# EAGLE design hatest (EAGLE 5.10)
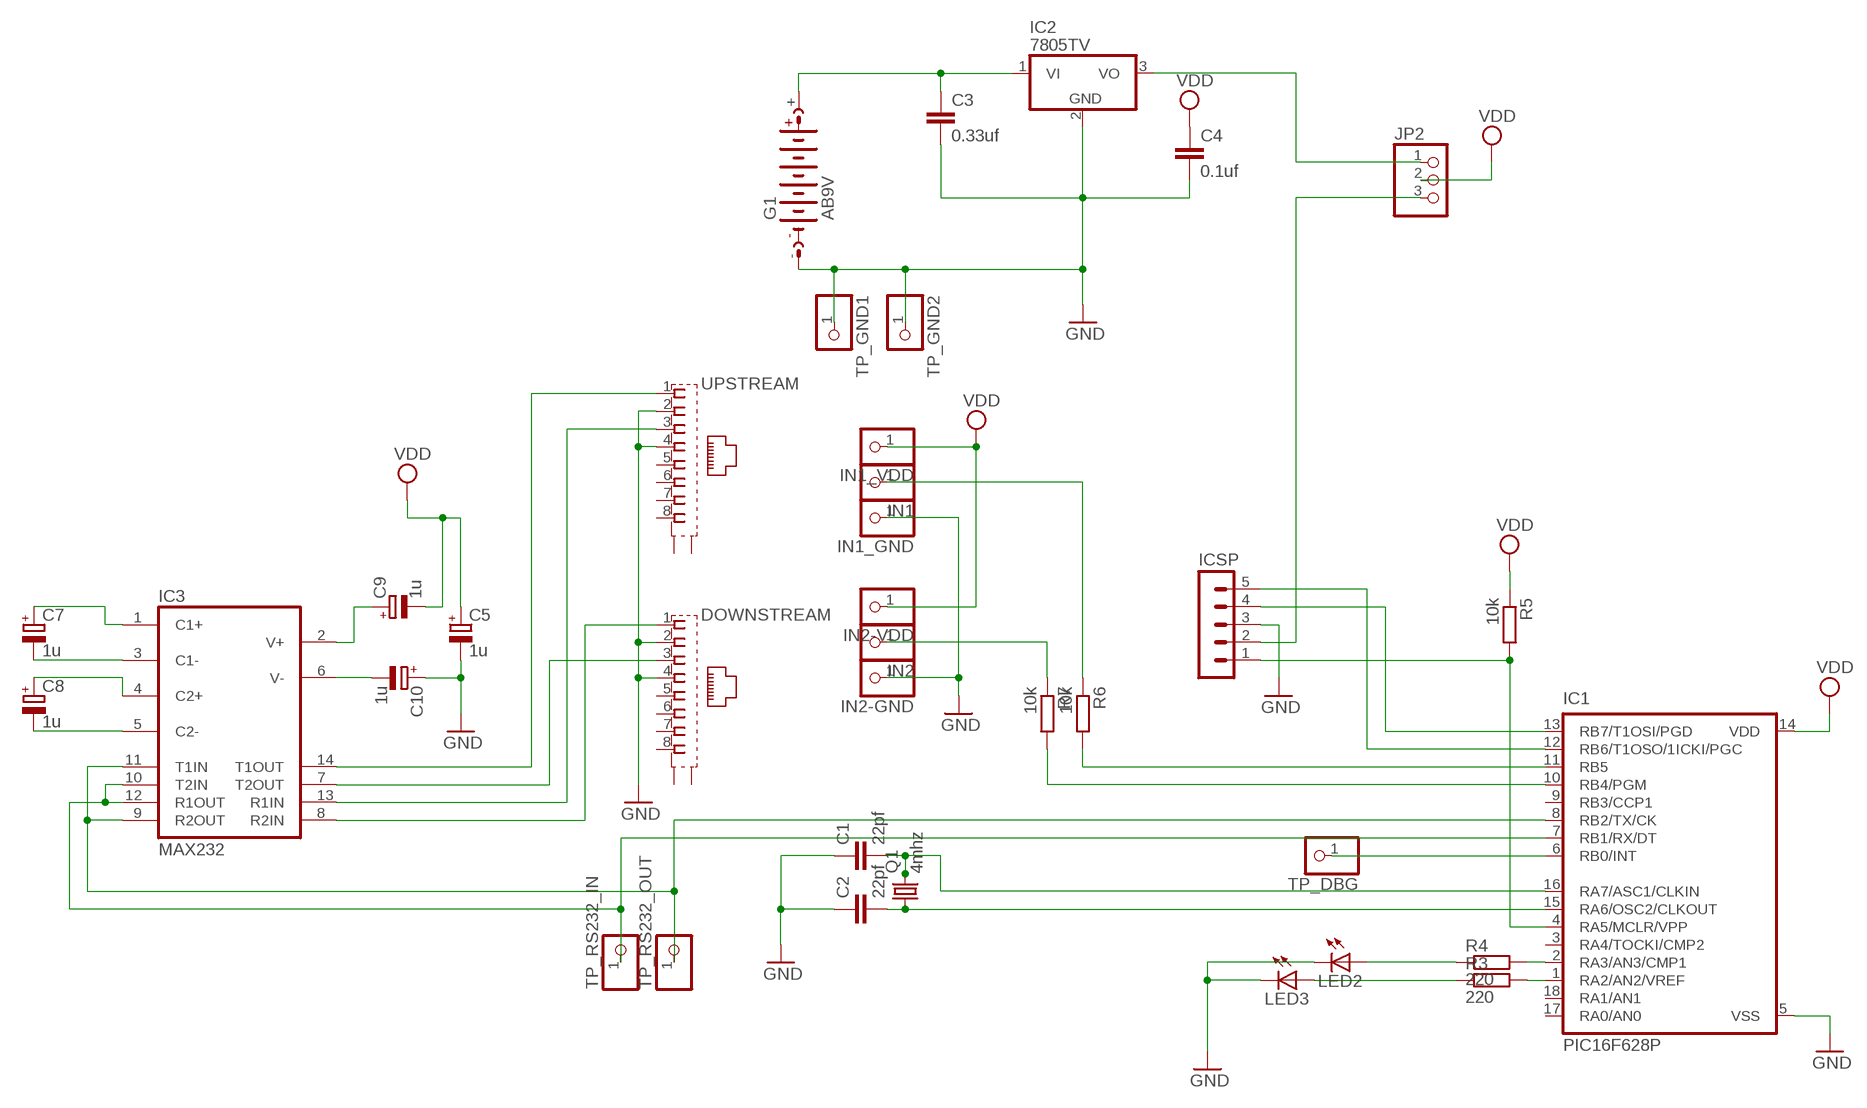
[diagram p0: schematic, sheet 1]

## Parts
C1  22pf  C-EU075-032X103  [C075-032X103]
C2  22pf  C-EU075-032X103  [C075-032X103]
C3  0.33uf  C5/3  [C5B3]
C4  0.1uf  C5/3  [C5B3]
C5  1u  CPOL-EUE2.5-6  [E2,5-6]
C7  1u  CPOL-EUE2.5-6  [E2,5-6]
C8  1u  CPOL-EUE2.5-6  [E2,5-6]
C9  1u  CPOL-EUE2.5-6  [E2,5-6]
C10  1u  CPOL-EUE2.5-6  [E2,5-6]
DOWNSTREAM  555153-1  [555153-1]
G1  AB9V  [AB9V]
IC1  PIC16F628P  [DIL18]
IC2  7805TV  [TO220V]
IC3  MAX232  [DIL16]
ICSP  MA05-1  [MA05-1]
IN1  PINHD-1X1  [1X01]
IN1_GND  PINHD-1X1  [1X01]
IN1_VDD  PINHD-1X1  [1X01]
IN2  PINHD-1X1  [1X01]
IN2-GND  PINHD-1X1  [1X01]
IN2-VDD  PINHD-1X1  [1X01]
JP2  PINHD-1X3  [1X03]
LED2  LED5MM  [LED5MM]
LED3  LED5MM  [LED5MM]
Q1  4mhz  CRYSTALHC49S  [HC49/S]
R3  220  R-EU_0411/15  [0411/15]
R4  220  R-EU_0411/15  [0411/15]
R5  10k  R-EU_0309/12  [0309/12]
R6  10k  R-EU_0204/5  [0204/5]
R7  10k  R-EU_0204/5  [0204/5]
TP_DBG  PINHD-1X1  [1X01]
TP_GND1  PINHD-1X1  [1X01]
TP_GND2  PINHD-1X1  [1X01]
TP_RS232_IN  PINHD-1X1  [1X01]
TP_RS232_OUT  PINHD-1X1  [1X01]
UPSTREAM  555153-1  [555153-1]

## Nets
9V: C3.1 G1.+ IC2.1(VI)
GND: C1.1 C2.1 C3.2 C4.2 C5.- C10.+ DOWNSTREAM.2 DOWNSTREAM.4 G1.- IC1.5(VSS) IC2.2(GND) ICSP.3 IN1_GND.1 IN2-GND.1 LED2.K(C) LED3.K(C) TP_GND1.1 TP_GND2.1 UPSTREAM.2 UPSTREAM.4
N$1: C1.2 IC1.16(RA7/ASC1/CLKIN) Q1.2
N$2: C2.2 IC1.15(RA6/OSC2/CLKOUT) Q1.1
N$3: IC1.7(RB1/RX/DT) IC3.10(T2IN) IC3.12(R1OUT) TP_RS232_IN.1
N$4: LED2.A R4.1
N$5: LED3.A R3.1
N$6: IC1.11(RB5) R6.2
N$7: IC1.2(RA3/AN3/CMP1) R4.2
N$8: IC1.1(RA2/AN2/VREF) R3.2
N$9: IC1.4(RA5/MCLR/VPP) ICSP.1 R5.2
N$10: IC1.13(RB7/T1OSI/PGD) ICSP.4
N$11: IC1.10(RB4/PGM) R7.2
N$12: IC1.12(RB6/T1OSO/1ICKI/PGC) ICSP.5
N$13: IC1.8(RB2/TX/CK) IC3.9(R2OUT) IC3.11(T1IN) TP_RS232_OUT.1
N$14: IC1.6(RB0/INT) TP_DBG.1
N$15: IN1.1 R6.1
N$16: IC3.13(R1IN) UPSTREAM.3
N$17: IC3.14(T1OUT) UPSTREAM.1
N$18: IN2.1 R7.1
N$19: C7.+ IC3.1(C1+)
N$20: DOWNSTREAM.3 IC3.7(T2OUT)
N$21: ICSP.2 JP2.3
N$22: DOWNSTREAM.1 IC3.8(R2IN)
N$23: C7.- IC3.3(C1-)
N$24: C8.- IC3.5(C2-)
N$25: C8.+ IC3.4(C2+)
N$26: C9.+ IC3.2(V+)
N$27: C10.- IC3.6(V-)
PROGRUN: IC2.3(VO) JP2.1
VDD: C4.1 C5.+ C9.- IC1.14(VDD) IN1_VDD.1 IN2-VDD.1 JP2.2 R5.1
Unconnected: DOWNSTREAM.5 DOWNSTREAM.6 DOWNSTREAM.7 DOWNSTREAM.8 DOWNSTREAM.G1(S1) DOWNSTREAM.G2(S2) IC1.3(RA4/TOCKI/CMP2) IC1.9(RB3/CCP1) IC1.17(RA0/AN0) IC1.18(RA1/AN1) UPSTREAM.5 UPSTREAM.6 UPSTREAM.7 UPSTREAM.8 UPSTREAM.G1(S1) UPSTREAM.G2(S2)

## Power pins joined to a net without a drawn wire
GND: IC3.15(GND)
VCC: IC3.16(VCC)

## Library data of the parts
C1 C2 = resistor:C-EU: CAPACITOR, European symbol
C3 C4 = capacitor-wima:C: CAPACITOR naming: grid - package width
C5 C7-C10 = rcl:CPOL-EU: POLARIZED CAPACITOR, European symbol
DOWNSTREAM UPSTREAM = con-amp:555153-1: AMP connector
G1 = battery:AB9V: 9-V BATTERY CLIP
IC1 = microchip:PIC16*F62: FLASH-Based 8-Bit CMOS Microcontroller Source: http://ww1.microchip.com/downloads/en/DeviceDoc/40300C.pdf
IC2 = linear:78*: Positive VOLTAGE REGULATOR Source: http://cache.national.com/ds/LM/LM78L05.pdf http://www.fairchildsemi.com/ds/LM/LM7805.pdf
IC3 = maxim:MAX232: RS232 TRANSEIVER
ICSP = con-lstb:MA05-1: PIN HEADER
IN1 IN1_GND IN1_VDD IN2 IN2-GND IN2-VDD TP_DBG TP_GND1 TP_GND2 TP_RS232_IN TP_RS232_OUT = pinhead:PINHD-1X1: PIN HEADER
JP2 = pinhead:PINHD-1X3: PIN HEADER
LED2 LED3 = led:LED: LED OSRAM: - CHIPLED LG R971, LG N971, LY N971, LG Q971, LY Q971, LO R971, LY R971 LH N974, LH R974 LS Q976, LO Q976, LY Q976 LO Q996 - Hyper CHIPLED LW Q18S LB Q993, LB Q99A, LB R99A - SideLED LS A670, LO A670, LY A670, LG A670, LP A670 LB A673, LV A673, LT A673, LW A673 LH A674 LY A675 LS A676, LA A676, LO A676, LY A676, LW A676 LS A679, LY A679, LG A679 - Hyper Micro SIDELED® LS Y876, LA Y876, LO Y876, LY Y876 LT Y87S - SmartLED LW L88C, LW L88S LB L89C, LB L89S, LG L890 LS L89K, LO L89K, LY L89K LS L896, LA L896, LO L896, LY L896 - TOPLED LS T670, LO T670, LY T670, LG T670, LP T670 LSG T670, LSP T670, LSY T670, LOP T670, LYG T670 LG T671, LOG T671, LSG T671 LB T673, LV T673, LT T673, LW T673 LH T674 LS T676, LA T676, LO T676, LY T676, LB T676, LH T676, LSB T676, LW T676 LB T67C, LV T67C, LT T67C, LS T67K, LO T67K, LY T67K, LW E67C LS E67B, LA E67B, LO E67B, LY E67B, LB E67C, LV E67C, LT E67C LW T67C LS T679, LY T679, LG T679 LS T770, LO T770, LY T770, LG T770, LP T770 LB T773, LV T773, LT T773, LW T773 LH T774 LS E675, LA E675, LY E675, LS T675 LS T776, LA T776, LO T776, LY T776, LB T776 LHGB T686 LT T68C, LB T68C - Hyper Mini TOPLED® LB M676 - Mini TOPLED Santana® LG M470 LS M47K, LO M47K, LY M47K Source: http://www.osram.convergy.de - LUMILED® LXK2-PW12-R00, LXK2-PW12-S00, LXK2-PW14-U00, LXK2-PW14-V00 LXK2-PM12-R00, LXK2-PM12-S00, LXK2-PM14-U00 LXK2-PE12-Q00, LXK2-PE12-R00, LXK2-PE12-S00, LXK2-PE14-T00, LXK2-PE14-U00 LXK2-PB12-K00, LXK2-PB12-L00, LXK2-PB12-M00, LXK2-PB14-N00, LXK2-PB14-P00, LXK2-PB14-Q00 LXK2-PR12-L00, LXK2-PR12-M00, LXK2-PR14-Q00, LXK2-PR14-R00 LXK2-PD12-Q00, LXK2-PD12-R00, LXK2-PD12-S00 LXK2-PH12-R00, LXK2-PH12-S00 LXK2-PL12-P00, LXK2-PL12-Q00, LXK2-PL12-R00 Source: www.luxeon.com
Q1 = crystal:CRYSTAL: CRYSTAL
R3-R7 = rcl:R-EU_: RESISTOR, European symbol

## Board
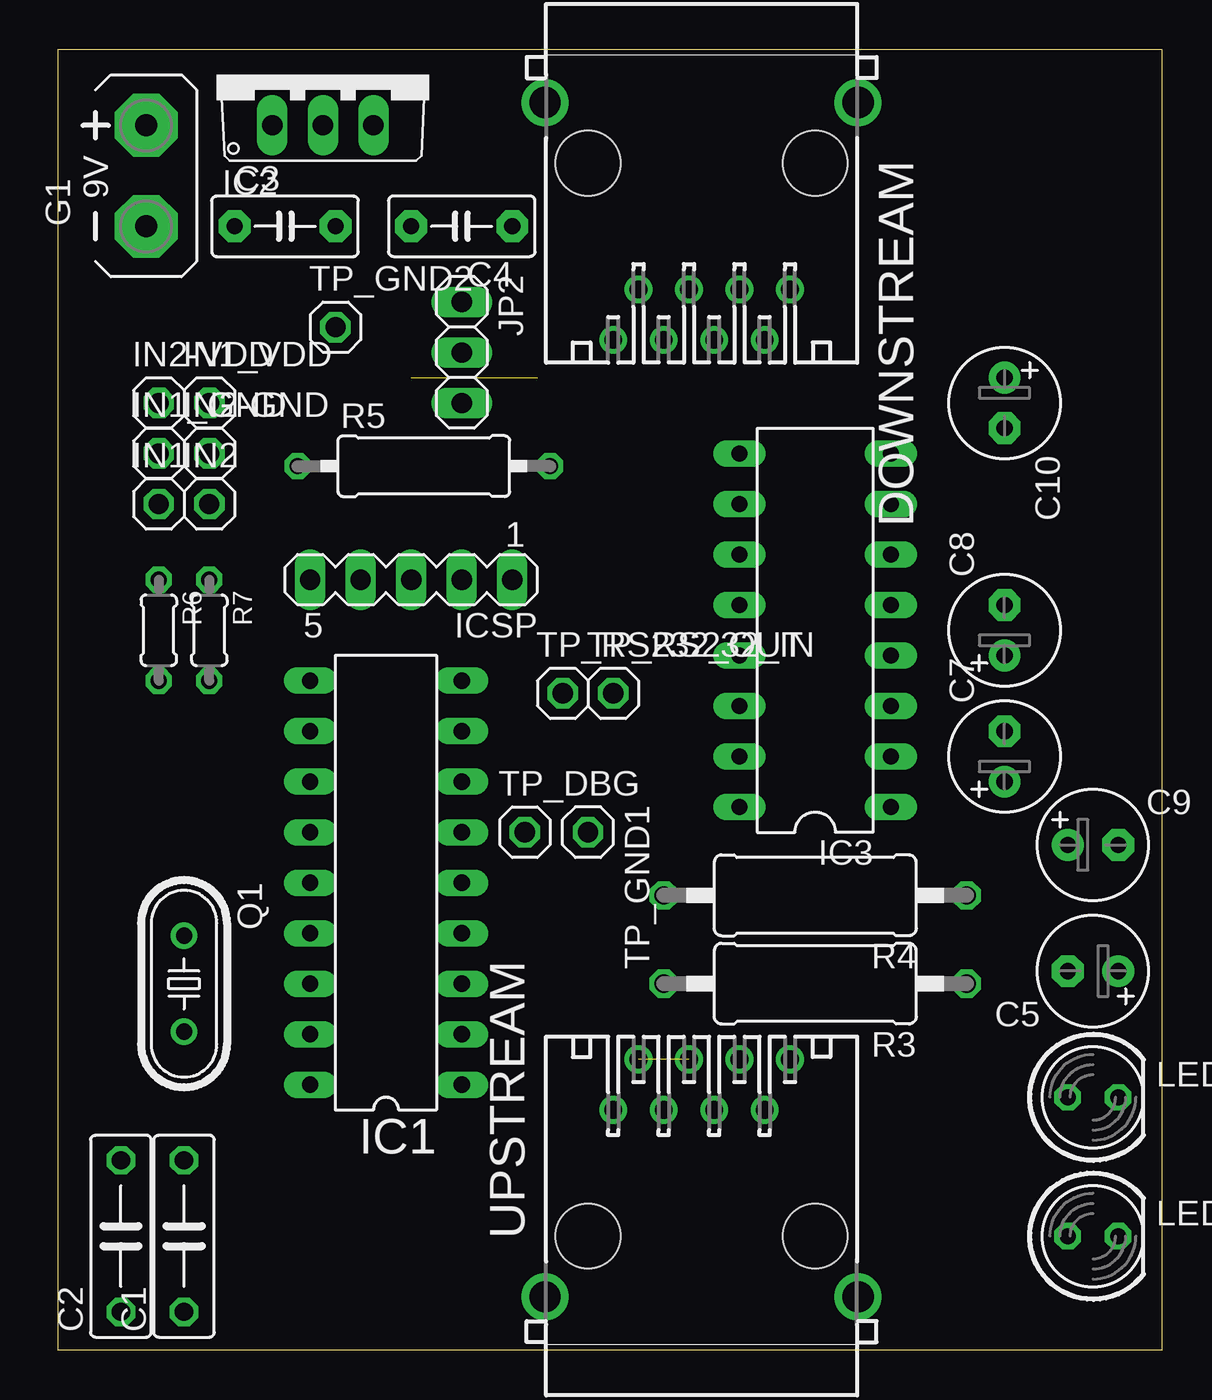
[diagram p1: board, top side]
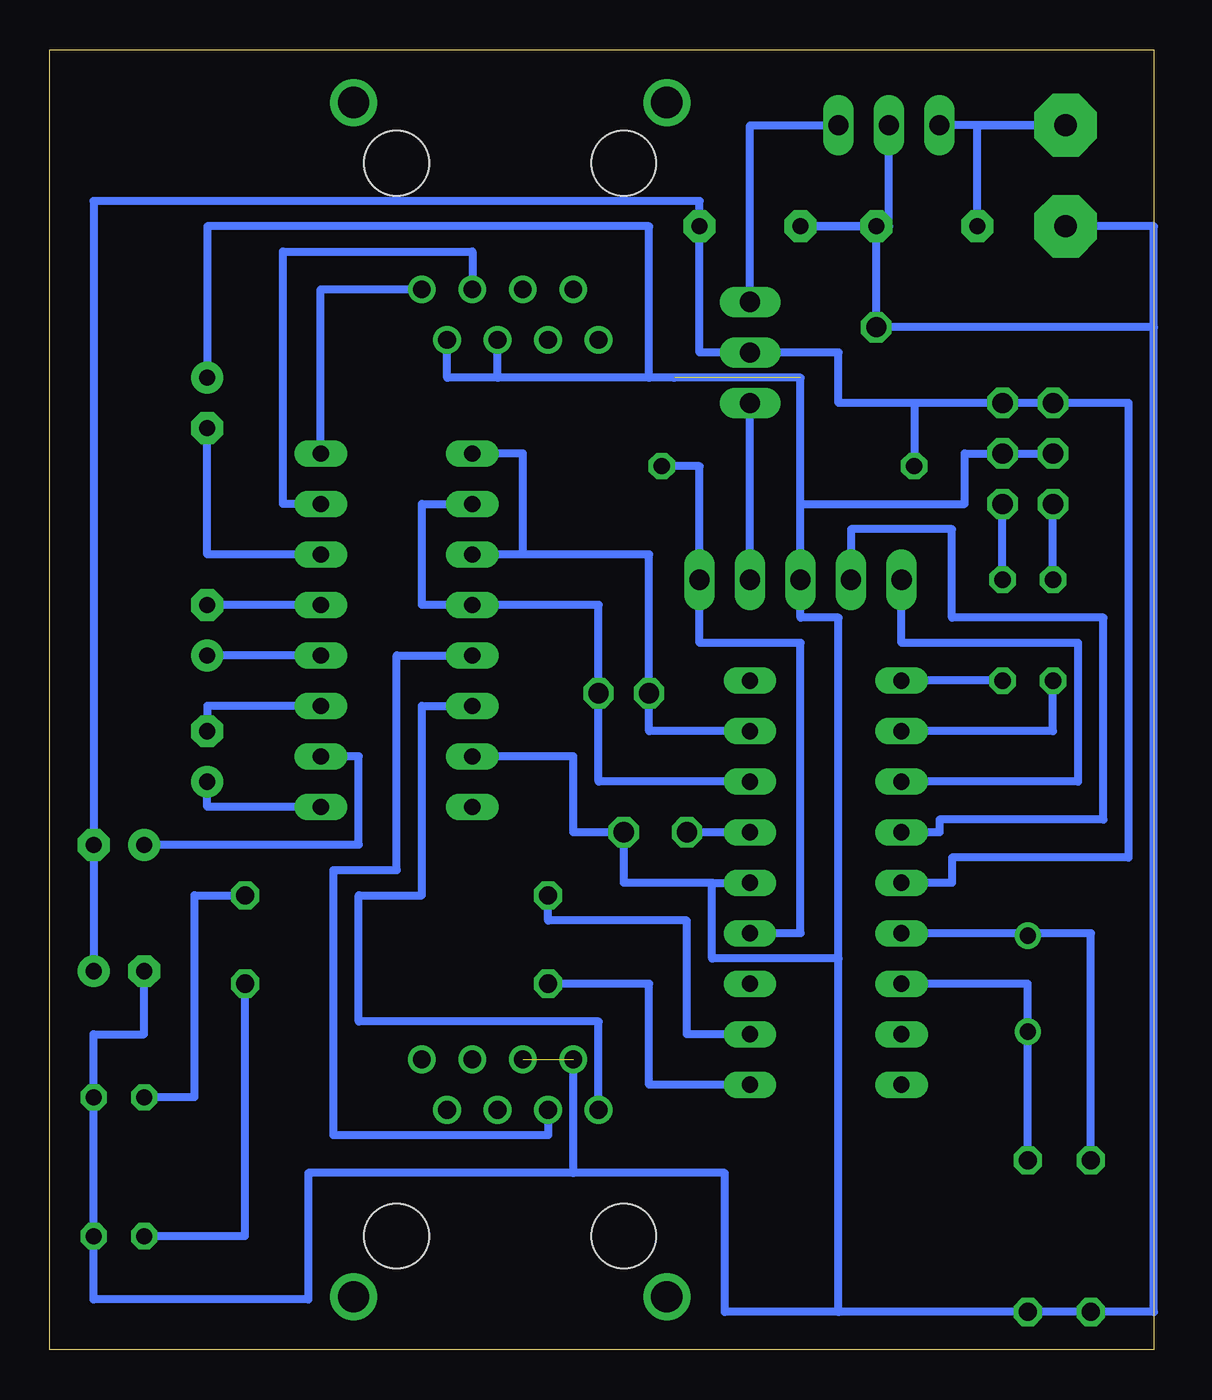
[diagram p2: board, bottom side, seen from below]

Size 55.55 x 65.39 mm. Coordinates in mm from the lower left corner, seen from the top.
Outline: 0,0 55.55,0 55.55,65.39 0,65.39 0,0
Copper layers (1*16): Top 0.035mm / dielectric 1.5mm / Bottom 0.035mm
Design rules "default": minimum track width 10mil, minimum drill 24mil, track to track 8mil, track to pad 8mil, pad to pad 8mil, via to via 8mil, smd to smd 8mil, copper to edge 40mil, drill to drill 8mil, minimum pad ring 10mil, minimum via ring 8mil, stop-mask expansion 4mil, vias tented up to drill 0mil, thermal gap 10mil

### Footprints (pad centres in the part's own frame; a part is rotated, then mirrored left to right if it is on the bottom)
C075-032X103 = drill 0.914 octagon: 1 -3.81,0; 2 3.81,0
C5B3 = drill 0.813 pad 1.6 octagon: 1 -2.54,0; 2 2.54,0
E2,5-6 = drill 0.813 pad 1.6 round: + -1.27,0 | drill 0.813 pad 1.6 octagon: - 1.27,0
555153-1 = drill 0.889 round: 1 -4.445,6.35; 2 -3.175,8.89; 3 -1.905,6.35; 4 -0.635,8.89; 5 0.635,6.35; 6 1.905,8.89; 7 3.175,6.35; 8 4.445,8.89 | drill 1.575 pad 2.184 round: G1 -7.874,-3.048; G2 7.874,-3.048 | hole 3.251: -5.715,0; 5.715,0
AB9V = drill 1.118 pad 3.15 octagon: + 0,2.54; - 0,-2.54
DIL18 = drill 0.813 long: 1 -10.16,-3.81; 2 -7.62,-3.81; 3 -5.08,-3.81; 4 -2.54,-3.81; 5 0,-3.81; 6 2.54,-3.81; 7 5.08,-3.81; 8 7.62,-3.81; 9 10.16,-3.81; 10 10.16,3.81; 11 7.62,3.81; 12 5.08,3.81; 13 2.54,3.81; 14 0,3.81; 15 -2.54,3.81; 16 -5.08,3.81; 17 -7.62,3.81; 18 -10.16,3.81
TO220V = drill 1.016 long: 1 -2.54,-2.54; 2 0,-2.54; 3 2.54,-2.54
DIL16 = drill 0.813 long: 1 -8.89,-3.81; 2 -6.35,-3.81; 3 -3.81,-3.81; 4 -1.27,-3.81; 5 1.27,-3.81; 6 3.81,-3.81; 7 6.35,-3.81; 8 8.89,-3.81; 9 8.89,3.81; 10 6.35,3.81; 11 3.81,3.81; 12 1.27,3.81; 13 -1.27,3.81; 14 -3.81,3.81; 15 -6.35,3.81; 16 -8.89,3.81
MA05-1 = drill 1.016 long: 1 -5.08,0; 2 -2.54,0; 3 0,0; 4 2.54,0; 5 5.08,0
1X01 = drill 1.016 octagon: 1 0,0
1X03 = drill 1.016 long: 1 -2.54,0; 2 0,0; 3 2.54,0
LED5MM = drill 0.813 octagon: A -1.27,0; K 1.27,0
HC49/S = drill 0.813 round: 1 -2.413,0; 2 2.413,0
0411/15 = drill 0.914 octagon: 1 -7.62,0; 2 7.62,0
0309/12 = drill 0.813 octagon: 1 -6.35,0; 2 6.35,0
0204/5 = drill 0.813 octagon: 1 -2.54,0; 2 2.54,0

### Placement (x,y rotation side)
C1  6.35,5.71 90 top
C2  3.17,5.71 90 top
C3  11.43,56.52 0 top
C4  20.32,56.52 180 top
C5  52.07,19.05 180 top
C7  47.62,29.85 90 top
C8  47.62,36.19 90 top
C9  52.07,25.4 0 top
C10  47.62,47.62 270 top
DOWNSTREAM  32.38,59.69 180 top
G1  4.45,59.05 0 top
IC1  16.51,23.5 90 top
IC2  13.34,64.13 0 top
IC3  38.1,36.19 90 top
ICSP  17.78,38.73 180 top
IN1  5.08,42.55 0 top
IN1_GND  5.08,45.08 0 top
IN1_VDD  7.62,47.62 0 top
IN2  7.62,42.55 0 top
IN2-GND  7.62,45.08 0 top
IN2-VDD  5.08,47.62 0 top
JP2  20.32,50.16 270 top
LED2  52.07,12.7 0 top
LED3  52.07,5.71 0 top
Q1  6.35,18.42 270 top
R3  38.1,18.42 180 top
R4  38.1,22.86 180 top
R5  18.41,44.45 0 top
R6  5.08,36.19 270 top
R7  7.62,36.19 270 top
TP_DBG  23.49,26.04 0 top
TP_GND1  26.67,26.04 270 top
TP_GND2  13.97,51.44 0 top
TP_RS232_IN  27.94,33.02 0 top
TP_RS232_OUT  25.4,33.02 0 top
UPSTREAM  32.38,5.71 0 top

### Tracks (layer width: path | path; a pad name or v marks a point on that pad's centre or on a via)
9V
  Bottom 0.406: C3.1 8.89,61.59 G1.+ IC2.1
GND  (2 unrouted)
  Bottom 0.406: 17.78,42.55 9.53,42.55 9.53,45.08 IN2-GND.1 IN1_GND.1 | 15.88,1.91 C1.1 C2.1 0,1.91 0,51.44 | 15.88,1.91 15.88,19.68 | 15.88,19.68 15.88,36.83 17.78,36.83 ICSP.3 17.78,42.55 | 0,51.44 TP_GND2.1 C3.2 C4.2 13.34,56.52 IC2.2 | G1.- 0,56.52 0,51.44 | 17.78,42.55 17.78,48.89 33.02,48.89 | 24.13,48.89 25.4,48.89 25.4,56.52 47.62,56.52 C10.+ | IC3.15 29.21,29.85 29.21,26.04 TP_GND1.1 26.67,23.5 22.22,23.5 | 22.22,23.5 IC1.5 | C5.- 50.8,15.88 53.34,15.88 LED2.K LED3.K 53.34,2.54 42.55,2.54 42.55,8.89 29.21,8.89 | 29.21,8.89 UPSTREAM.2 | 29.21,8.89 21.59,8.89 21.59,1.91 15.88,1.91 | 33.02,48.89 DOWNSTREAM.4 | 33.02,48.89 35.56,48.89 DOWNSTREAM.2 | 22.22,23.5 22.22,19.68 15.88,19.68
N$1
  Bottom 0.406: IC1.16 6.35,18.42 Q1.2 C1.2
N$2
  Bottom 0.406: 6.35,20.96 IC1.15 | C2.2 3.17,20.96 6.35,20.96 | 6.35,20.96 Q1.1
N$3
  Bottom 0.406: IC1.7 27.94,28.57 TP_RS232_IN.1 27.94,37.47 IC3.12 36.83,37.47 36.83,42.55 IC3.10
N$4
  Bottom 0.406: LED2.A 48.26,12.7 48.26,22.86 R4.1
N$5
  Bottom 0.406: LED3.A 45.72,5.71 R3.1
N$6
  Bottom 0.406: IC1.11 5.08,31.11 R6.2
N$7
  Bottom 0.406: R4.2 30.48,21.59 23.49,21.59 23.49,15.88 IC1.2
N$8
  Bottom 0.406: IC1.1 25.4,13.34 25.4,18.42 R3.2
N$9
  Bottom 0.406: IC1.4 17.78,20.96 17.78,35.56 22.86,35.56 ICSP.1 22.86,44.45 R5.2
N$10
  Bottom 0.406: IC1.13 10.8,26.04 10.8,26.67 2.54,26.67 2.54,36.83 10.16,36.83 10.16,41.28 15.24,41.28 ICSP.4
N$11
  Bottom 0.406: R7.2 IC1.10
N$12
  Bottom 0.406: ICSP.5 12.7,35.56 3.81,35.56 3.81,28.57 IC1.12
N$13
  Bottom 0.406: IC1.8 25.4,31.11 TP_RS232_OUT.1 25.4,40 31.75,40 | 31.75,40 IC3.11 | 31.75,40 31.75,45.08 IC3.9
N$14
  Bottom 0.406: IC1.6 TP_DBG.1
N$15
  Bottom 0.406: R6.1 IN1.1
N$16
  Bottom 0.406: IC3.13 38.1,34.92 38.1,24.13 41.27,24.13 41.27,10.79 30.48,10.79 UPSTREAM.3
N$17
  Bottom 0.406: IC3.14 36.83,32.39 36.83,22.86 40.01,22.86 40.01,16.51 27.94,16.51 UPSTREAM.1
N$18
  Bottom 0.406: R7.1 IN2.1
N$19
  Bottom 0.406: C7.+ 47.62,27.3 IC3.1
N$20
  Bottom 0.406: IC3.7 43.81,42.55 43.81,55.24 34.29,55.24 DOWNSTREAM.3
N$21
  Bottom 0.406: ICSP.2 JP2.3
N$22
  Bottom 0.406: IC3.8 41.91,53.34 DOWNSTREAM.1
N$23
  Bottom 0.406: C7.- 47.62,32.39 IC3.3
N$24
  Bottom 0.406: IC3.5 C8.-
N$25
  Bottom 0.406: IC3.4 C8.+
N$26
  Bottom 0.406: IC3.2 40.01,29.85 40.01,25.4 C9.+
N$27
  Bottom 0.406: IC3.6 47.62,40 C10.-
PROGRUN
  Bottom 0.406: JP2.1 20.32,61.59 IC2.3
VDD
  Bottom 0.406: IC1.14 10.16,23.5 10.16,24.76 1.27,24.76 1.27,47.62 IN2-VDD.1 IN1_VDD.1 12.07,47.62 | 12.07,47.62 15.88,47.62 15.88,50.16 JP2.2 22.86,50.16 C4.1 22.86,57.78 53.34,57.78 C9.- C5.+ | 12.07,47.62 R5.1